# EAGLE design sqw23 (EAGLE 7.1.0)
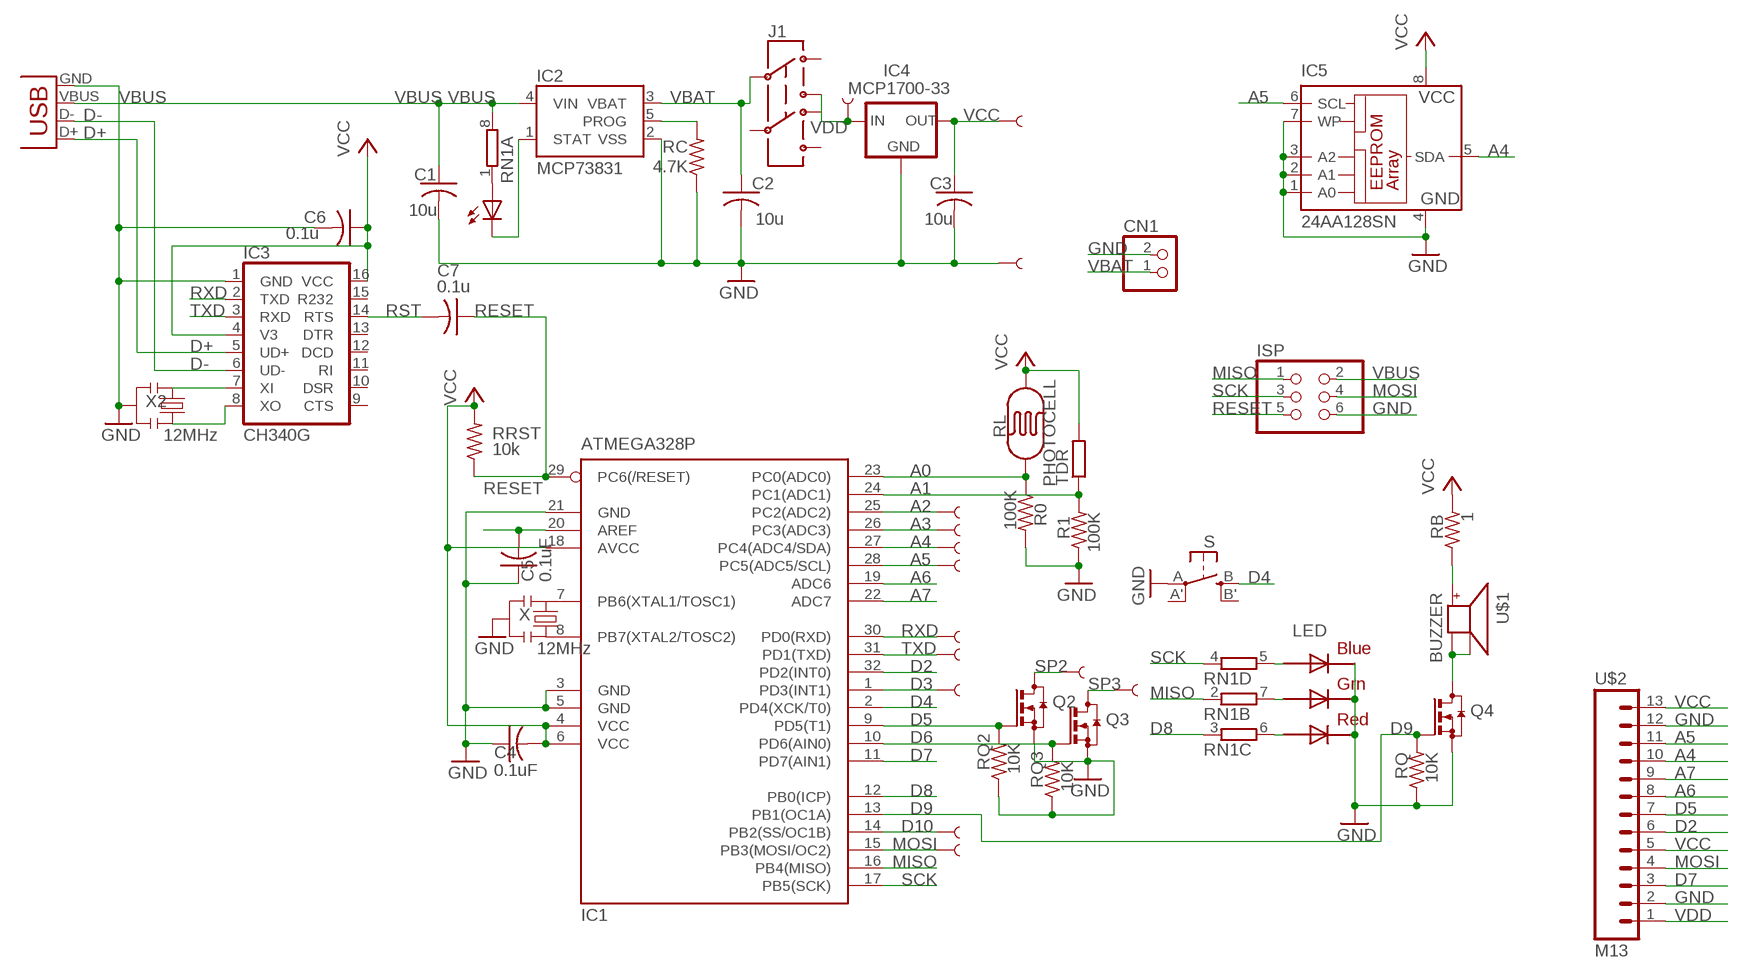
[diagram p0: schematic, sheet 1]

## Parts
C1  10u  C-USC0805K  [C0805K]
C2  10u  C-USC0805K  [C0805K]
C3  10u  C-USC0805K  [C0805K]
C4  0.1uF  C-USC0805K  [C0805K]
C5  0.1uF  C-USC0805K  [C0805K]
C6  0.1u  C-USC0805K  [C0805K]
C7  0.1u  C-USC0805K  [C0805K]
CHG  0805  LEDCHIPLED_0805  [CHIPLED_0805]
CN1  JST_2PIN-SMT-RA  [JST-PH-2-SMT-RA]
IC1  ATMEGA328P  MEGA8-AI  [TQFP32-08]
IC2  MCP73831  [SOT23-5]
IC3  CH340G  [SO16]
IC4  MCP1700-33  MCP1700SOT89  [SOT89]
IC5  24AA128SN  [SO-08]
ISP  PINHD-2X3  [2X03]
J1  AYZ0202  [AYZ0202]
LED  RGBLED5050  [RGBLED5050]
PAD_3  SEWTAP6  SEWTAP611  [PETAL-SMALL-2SIDE11]
PAD_5  SEWTAP6  SEWTAP61  [PETAL-SMALL-2SIDE1]
PAD_6  SEWTAP6  SEWTAP61  [PETAL-SMALL-2SIDE1]
PAD_10  SEWTAP6  SEWTAP611  [PETAL-SMALL-2SIDE11]
PAD_11  SEWTAP6  SEWTAP61  [PETAL-SMALL-2SIDE1]
PAD_A2  SEWTAP6  SEWTAP61  [PETAL-SMALL-2SIDE1]
PAD_A3  SEWTAP6  SEWTAP61  [PETAL-SMALL-2SIDE1]
PAD_A4  SEWTAP6  SEWTAP611  [PETAL-SMALL-2SIDE11]
PAD_A5  SEWTAP6  SEWTAP611  [PETAL-SMALL-2SIDE11]
PAD_GND  SEWTAP6  SEWTAP611  [PETAL-SMALL-2SIDE11]
PAD_RXD  SEWTAP61  [PETAL-SMALL-2SIDE1]
PAD_TXD  SEWTAP6  SEWTAP61  [PETAL-SMALL-2SIDE1]
PAD_VBAT  SEWTAP6  SEWTAP61  [PETAL-SMALL-2SIDE1]
PAD_VCC  SEWTAP6  SEWTAP611  [PETAL-SMALL-2SIDE11]
Q2  BSS123  [SOT23]
Q3  BSS123  [SOT23]
Q4  BSS123  [SOT23]
R0  100K  R-US_R0805  [R0805]
R1  100K  R-US_R0805  [R0805]
RB  1  R-US_R0805  [R0805]
RC  4.7K  R-US_R0805  [R0805]
RL  PHOTOCELL  PHOTOCELLPTH  [PHOTOCELL]
RN1  4R-NEXB38V  [EXB38V]
RQ  10K  R-US_R0805  [R0805]
RQ2  10K  R-US_R0805  [R0805]
RQ3  10K  R-US_R0805  [R0805]
RRST  10k  R-US_R0805  [R0805]
S  EVQQ2  [EVQ-Q2]
TDR  R-EU_V526-0  [V526-0]
U$1  BUZZER  [SMT-8585-BUZZER]
U$2  M13  [1X13]
X  12MHz  RESONATORSMD  [RESONATOR-SMD]
X1  USBSMD  [USB-MINIB]
X2  12MHz  RESONATORSMD  [RESONATOR-SMD]

## Nets
A0: IC1.23(PC0(ADC0)) R0.1 RL.1
A1: IC1.24(PC1(ADC1)) R1.2 TDR.1
A2: IC1.25(PC2(ADC2)) PAD_A2.1
A3: IC1.26(PC3(ADC3)) PAD_A3.1
A4: IC1.27(PC4(ADC4/SDA)) IC5.5(SDA) PAD_A4.1 U$2.10
A5: IC1.28(PC5(ADC5/SCL)) IC5.6(SCL) PAD_A5.1 U$2.11
A6: IC1.19(ADC6) U$2.8
A7: IC1.22(ADC7) U$2.9
AREF: C5.2 IC1.20(AREF)
D2: IC1.32(PD2(INT0)) U$2.6
D3: IC1.1(PD3(INT1)) PAD_3.1
D4: IC1.2(PD4(XCK/T0)) S.B(S)
D5: IC1.9(PD5(T1)) Q2.1(G) RQ2.2 U$2.7
D6: IC1.10(PD6(AIN0)) Q3.1(G) RQ3.2
D7: IC1.11(PD7(AIN1)) U$2.3
D8: IC1.12(PB0(ICP)) RN1.3
D9: IC1.13(PB1(OC1A)) Q4.1(G) RQ.2
D10: IC1.14(PB2(SS/OC1B)) PAD_10.1
D+: IC3.5(UD+) X1.D+
D-: IC3.6(UD-) X1.D-
GND: C1.2 C2.2 C3.2 C4.1 C5.1 C6.2 CN1.2 IC1.3(GND) IC1.5(GND) IC1.21(GND) IC2.2(VSS) IC3.1(GND) IC4.1(GND) IC5.1(A0) IC5.2(A1) IC5.3(A2) IC5.4(GND) IC5.7(WP) ISP.6 LED.4(BLUE_C) LED.5(RED_C) LED.6(GREEN_C) PAD_GND.1 Q2.2(S) Q3.2(S) Q4.2(S) R0.2 R1.1 RC.1 RQ2.1 RQ3.1 RQ.1 S.A(P) U$2.2 U$2.12 X1.GND X2.2 X.2
MISO: IC1.16(PB4(MISO)) ISP.1 RN1.2
MOSI: IC1.15(PB3(MOSI/OC2)) ISP.4 PAD_11.1 U$2.4
N$1: IC1.8(PB7(XTAL2/TOSC2)) X.3
N$2: IC1.7(PB6(XTAL1/TOSC1)) X.1
N$3: LED.3(BLUE_A) RN1.5
N$4: CHG.A RN1.1
N$5: CHG.C IC2.1(STAT)
N$6: IC2.5(PROG) RC.2
N$7: Q4.3(D) U$1.- U$1.A-
N$8: LED.1(GREEN_A) RN1.7
N$9: LED.2(RED_A) RN1.6
N$11: IC3.7(XI) X2.1
N$12: RB.1 U$1.+
N$13: IC3.8(XO) X2.3
RESET: C7.1 IC1.29(PC6(/RESET)) ISP.5 RRST.1
RST: C7.2 IC3.14(RTS)
RXD: IC1.30(PD0(RXD)) IC3.2(TXD) PAD_RXD.1
SCK: IC1.17(PB5(SCK)) ISP.3 RN1.4
SP2 [power]: PAD_5.1 Q2.3(D)
SP3 [power]: PAD_6.1 Q3.3(D)
TXD: IC1.31(PD1(TXD)) IC3.3(RXD) PAD_TXD.1
VBAT [power]: C2.1 CN1.1 IC2.3(VBAT) J1.2
VBUS [power]: C1.1 IC2.4(VIN) ISP.2 RN1.8 X1.VBUS
VCC: C3.1 C4.2 C6.1 IC1.4(VCC) IC1.6(VCC) IC1.18(AVCC) IC3.4(V3) IC3.16(VCC) IC4.3(OUT) IC5.8(VCC) PAD_VCC.1 RB.2 RL.2 RRST.2 TDR.2 U$2.5 U$2.13
VDD: IC4.2(IN) J1.1 PAD_VBAT.1 U$2.1
Unconnected: IC3.9(CTS) IC3.10(DSR) IC3.11(RI) IC3.12(DCD) IC3.13(DTR) IC3.15(R232) J1.3 J1.4 J1.5 J1.6 S.A'(P1) S.B'(S1)

## Library data of the parts
C1-C5 = adafruit2013:C-US: CAPACITOR, American symbol
C6 C7 = adafruit:C-US: CAPACITOR, American symbol
CHG = led:LED: LED OSRAM: - CHIPLED LG R971, LG N971, LY N971, LG Q971, LY Q971, LO R971, LY R971 LH N974, LH R974 LS Q976, LO Q976, LY Q976 LO Q996 - Hyper CHIPLED LW Q18S LB Q993, LB Q99A, LB R99A - SideLED LS A670, LO A670, LY A670, LG A670, LP A670 LB A673, LV A673, LT A673, LW A673 LH A674 LY A675 LS A676, LA A676, LO A676, LY A676, LW A676 LS A679, LY A679, LG A679 - Hyper Micro SIDELED® LS Y876, LA Y876, LO Y876, LY Y876 LT Y87S - SmartLED LW L88C, LW L88S LB L89C, LB L89S, LG L890 LS L89K, LO L89K, LY L89K LS L896, LA L896, LO L896, LY L896 - TOPLED LS T670, LO T670, LY T670, LG T670, LP T670 LSG T670, LSP T670, LSY T670, LOP T670, LYG T670 LG T671, LOG T671, LSG T671 LB T673, LV T673, LT T673, LW T673 LH T674 LS T676, LA T676, LO T676, LY T676, LB T676, LH T676, LSB T676, LW T676 LB T67C, LV T67C, LT T67C, LS T67K, LO T67K, LY T67K, LW E67C LS E67B, LA E67B, LO E67B, LY E67B, LB E67C, LV E67C, LT E67C LW T67C LS T679, LY T679, LG T679 LS T770, LO T770, LY T770, LG T770, LP T770 LB T773, LV T773, LT T773, LW T773 LH T774 LS E675, LA E675, LY E675, LS T675 LS T776, LA T776, LO T776, LY T776, LB T776 LHGB T686 LT T68C, LB T68C - Hyper Mini TOPLED® LB M676 - Mini TOPLED Santana® LG M470 LS M47K, LO M47K, LY M47K Source: http://www.osram.convergy.de LUXEON: - LUMILED® LXK2-PW12-R00, LXK2-PW12-S00, LXK2-PW14-U00, LXK2-PW14-V00 LXK2-PM12-R00, LXK2-PM12-S00, LXK2-PM14-U00 LXK2-PE12-Q00, LXK2-PE12-R00, LXK2-PE12-S00, LXK2-PE14-T00, LXK2-PE14-U00 LXK2-PB12-K00, LXK2-PB12-L00, LXK2-PB12-M00, LXK2-PB14-N00, LXK2-PB14-P00, LXK2-PB14-Q00 LXK2-PR12-L00, LXK2-PR12-M00, LXK2-PR14-Q00, LXK2-PR14-R00 LXK2-PD12-Q00, LXK2-PD12-R00, LXK2-PD12-S00 LXK2-PH12-R00, LXK2-PH12-S00 LXK2-PL12-P00, LXK2-PL12-Q00, LXK2-PL12-R00 Source: www.luxeon.com KINGBRIGHT: KA-3528ASYC Source: www.kingbright.com
CN1 = adafruit:JST_2PIN: JST 2-Pin Connectors of various flavors SMT-RA (S2B-PH-SM4) 4UConnector #17311 SMT (B2B-PH-SM4) THM-RA (S2B-PH) THM (B2B-PH)
IC1 = atmel:MEGA8: MICROCONTROLLER 8 Kbytes FLASH, 1 kbytes SRAM, 512 bytes EEPROM, USART, 6-channel 10 bit ADC, 2-channel 8 bit ADC Pin compatible with Atmega48, ATMega88, ATMega168 Source: avr.lbr; MPN: ATMEGA8-16AU; OC_FARNELL: 9171371; OC_NEWARK: 73M8863
IC2 = SparkFunNew:MCP73831: Microchip's MCP73831 Miniature single cell, fully integrated Li-Ion, Li-polymer charge management controller http://ww1.microchip.com/downloads/en/DeviceDoc/21984a.pdf
IC3 = SparkFunNew:CH340
IC4 = adafruit:MCP1700: VOLTAGE REGULATOR
IC5 = microchip:24*: Serial EEPROM I2C; MF: MICROCHIP; MPN: 24AA128-I/SN; OC_FARNELL: unknown; OC_NEWARK: 92C6842
ISP = pinhead:PINHD-2X3: PIN HEADER
J1 = SparkFunNew:AYZ0202: SPDT Slide Switch Simple SMD single-pull double-throw slide switch. Good for less than 350mA power switch, switching UARTs between devices, etc. Spark Fun Electronics SKU : COM-00597
LED = adafruit:RGBLED: For 5050 RGB LEDs, the order of the LEDs may vary from one manufacturer to another!
PAD_3 PAD_5 PAD_6 PAD_10 PAD_11 PAD_A2-PAD_A5 PAD_GND PAD_RXD PAD_TXD PAD_VBAT PAD_VCC = LilyPad-Wearables:SEWTAP
Q2-Q4 = transistor-small-signal:BSS123: N-CHANNEL MOS FET
R0 R1 RB RC RQ RQ2 RQ3 RRST = adafruit2013:R-US_: RESISTOR, American symbol
RL = SparkFunNew:PHOTOCELL: Photocell Also known as a CdS photoresistor. This is a low cost way to detect light levels. Resistance decreases with more incoming light. SparkFun SKU: SEN-09088
RN1 = resistor-dil:4R-N: Array Chip Resistor Source: RS Component / Phycomp; OC_FARNELL: unknown; OC_NEWARK: unknown
S = adafruit:EVQQ2: SMT 6mm switch, EVQQ2 series http://www.ladyada.net/library/eagle
TDR = resistor:R-EU_: RESISTOR, European symbol; SPICEPREFIX: R
U$1 = adafruit:BUZZER
U$2 = SparkFun:M13
X X2 = SparkFunNew:RESONATOR: Resonator Small SMD resonator. This is the itty bitty 10/20MHz resonators with built in caps. CSTCE10M0G55 and CSTCE20M0V53. Footprint has been reviewed closely but hasn't been tested yet.
X1 = SparkFun:USB: USB Connectors USB-B-PTH is fully proven SKU : PRT-00139 USB-miniB is fully proven SKU : PRT-00587 USB-A-PCB is untested. USB-A-H is throughly reviewed, but untested. Spark Fun Electronics SKU : PRT-00437 USB-B-SMT is throughly reviewed, but untested. Needs silkscreen touching up. USB-A-S has not been used/tested USB-MB-H has not been used/tested

## Net classes
0 default: width 0.178 mm, clearance 0.178 mm
1 power: width 0.254 mm, clearance 0.178 mm

## Board
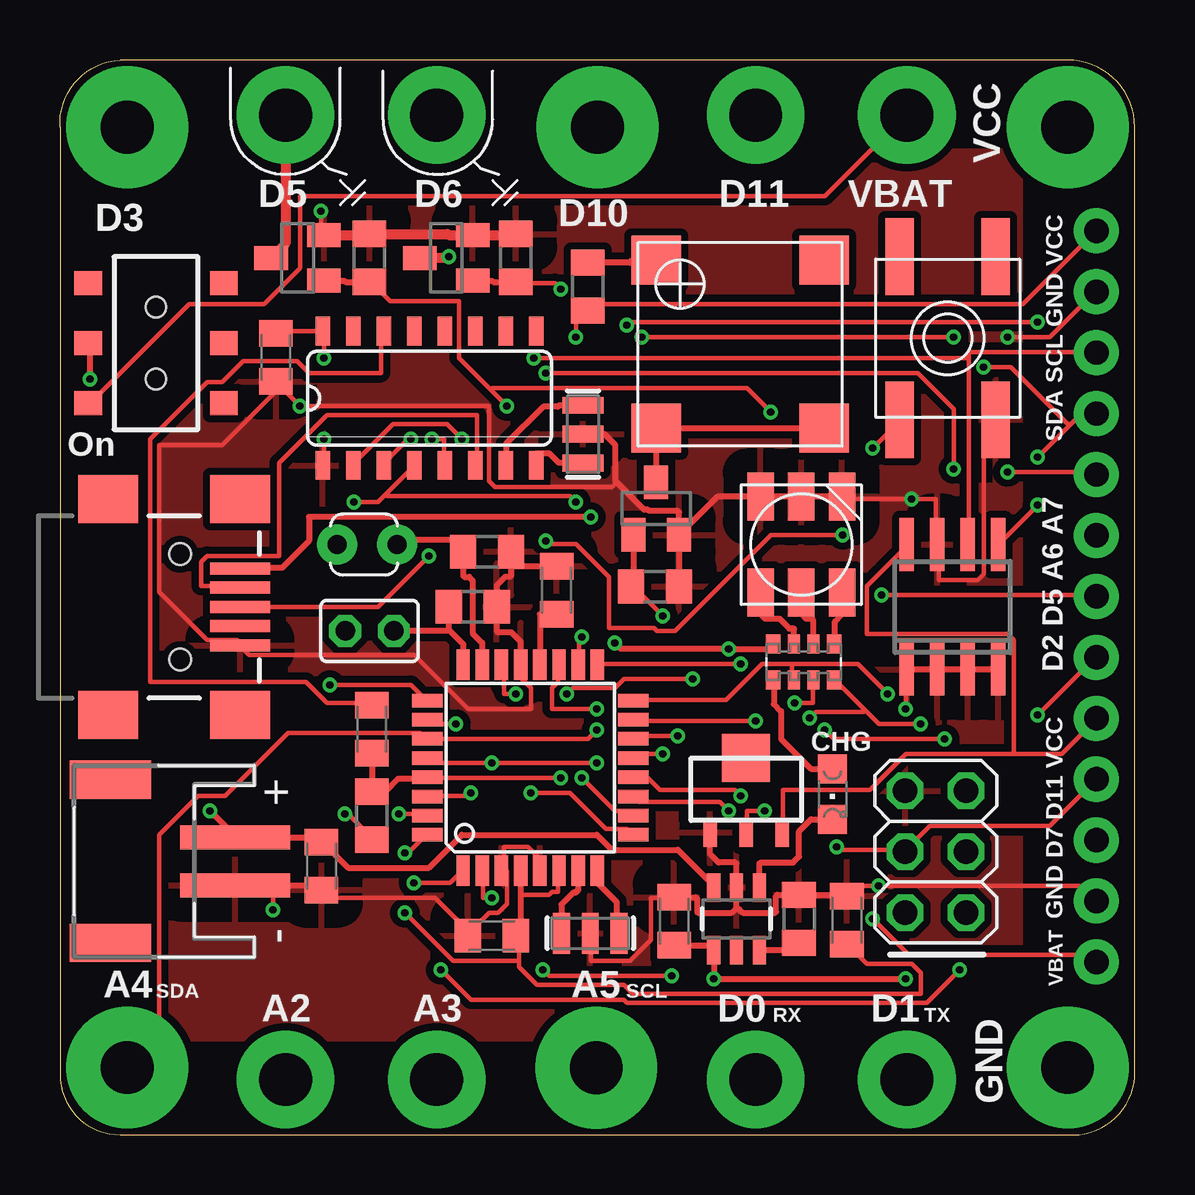
[diagram p1: board, top side]
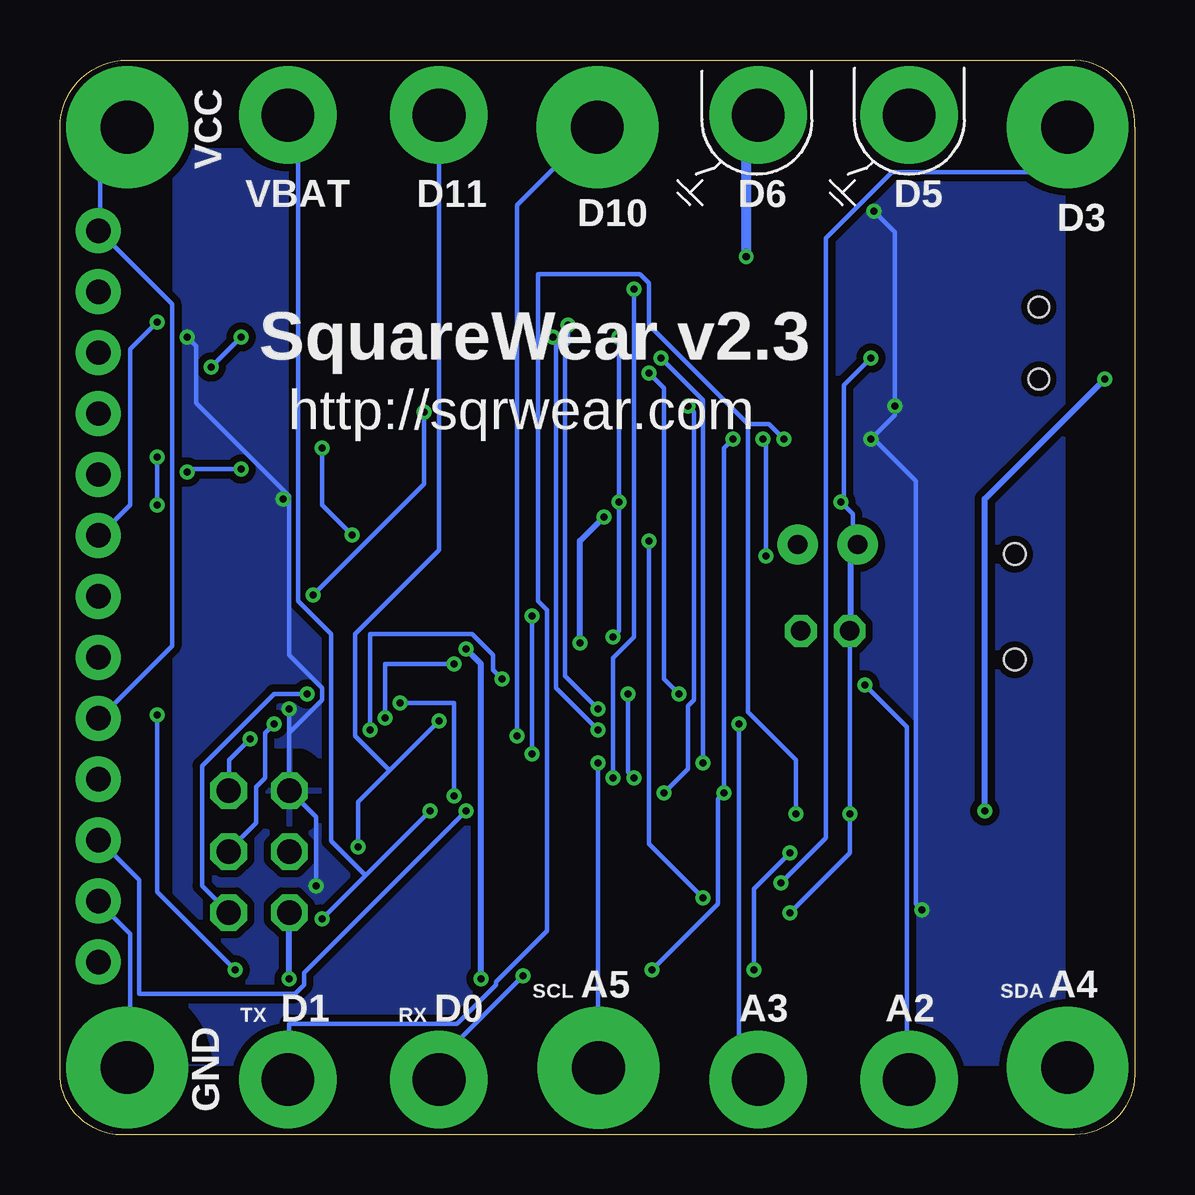
[diagram p2: board, bottom side, seen from below]

Size 44.8 x 44.81 mm. Coordinates in mm from the lower left corner, seen from the top.
Outline: 2.5,0.01 42,0.01 arc90 44.8,2.41 44.8,42.01 arc90 42,44.81 2.5,44.81 arc90 0,42.01 0,2.51 arc90 2.5,0.01
Copper layers (1*16): Top 0.035mm / dielectric 1.5mm / Bottom 0.035mm
Design rules "Fusion_eagle_rule_v1.1 *": minimum track width 6mil, minimum drill 12mil, track to track 6mil, track to pad 6mil, pad to pad 6mil, via to via 6mil, smd to smd 0mil, copper to edge 10mil, drill to drill 10mil, minimum pad ring 10mil, minimum via ring 6mil, stop-mask expansion 2mil, vias tented up to drill 100mil, thermal gap 40mil
vRestrict: area 41.1,6.2 to 41.8,38.8; area 1.8,5.7 to 5.6,6.8; area 8.5,4.7 to 10.4,5.8; area 14.7,4.7 to 16.5,5.8; area 21.3,5.7 to 25.1,6.8; area 27.4,4.7 to 30.7,5.8; area 33.9,4.7 to 37.3,5.8; area 14.5,38.7 to 16.8,39.8; area 20.5,37.8 to 23.4,39; area 27.2,38.7 to 30.2,39.8

### Footprints (pad centres in the part's own frame; a part is rotated, then mirrored left to right if it is on the bottom)
C0805K = smd 1.1 x 1.4: 1 -1,0; 2 1,0
CHIPLED_0805 = smd 1.2 x 1.2: A 0,-1.05; C 0,1.05
JST-PH-2-SMT-RA = smd 1 x 4.6: 1 1,-3.7; 2 -1,-3.7 | smd 1.6 x 3.4: NC1 -3.4,1.5; NC2 3.4,1.5
TQFP32-08 = smd 1.27 x 0.559: 1 -4.293,2.8; 2 -4.293,2; 3 -4.293,1.2; 4 -4.293,0.4; 5 -4.293,-0.4; 6 -4.293,-1.2; 7 -4.293,-2; 8 -4.293,-2.8; 17 4.293,-2.8; 18 4.293,-2; 19 4.293,-1.2; 20 4.293,-0.4; 21 4.293,0.4; 22 4.293,1.2; 23 4.293,2; 24 4.293,2.8 | smd 0.559 x 1.27: 9 -2.8,-4.293; 10 -2,-4.293; 11 -1.2,-4.293; 12 -0.4,-4.293; 13 0.4,-4.293; 14 1.2,-4.293; 15 2,-4.293; 16 2.8,-4.293; 25 2.8,4.293; 26 2,4.293; 27 1.2,4.293; 28 0.4,4.293; 29 -0.4,4.293; 30 -1.2,4.293; 31 -2,4.293; 32 -2.8,4.293
SOT23-5 = smd 0.55 x 1.2: 1 -0.95,-1.3; 2 0,-1.3; 3 0.95,-1.3; 4 0.95,1.3; 5 -0.95,1.3; 6 0,1.3
SO16 = smd 0.6 x 1.2: 1 -4.445,-2.8; 2 -3.175,-2.8; 3 -1.905,-2.8; 4 -0.635,-2.8; 5 0.635,-2.8; 6 1.905,-2.8; 7 3.175,-2.8; 8 4.445,-2.8; 9 4.445,2.8; 10 3.175,2.8; 11 1.905,2.8; 12 0.635,2.8; 13 -0.635,2.8; 14 -1.905,2.8; 15 -3.175,2.8; 16 -4.445,2.8
SOT89 = smd 0.58 x 1.2: 1 -1.5,-1.8; 2 0,-1.8; 3 1.5,-1.8 | smd 2 x 2: 4 0,1.3
SO-08 = smd 0.6 x 2.2: 1 -1.905,-2.6; 2 -0.635,-2.6; 3 0.635,-2.6; 4 1.905,-2.6; 5 1.905,2.6; 6 0.635,2.6; 7 -0.635,2.6; 8 -1.905,2.6
2X03 = drill 1.016 octagon: 1 -2.54,-1.27; 2 -2.54,1.27; 3 0,-1.27; 4 0,1.27; 5 2.54,-1.27; 6 2.54,1.27
AYZ0202 = smd 1 x 1.15: 1 -2.5,2.825; 2 0,2.825; 3 2.5,2.825; 4 -2.5,-2.825; 5 0,-2.825; 6 2.5,-2.825 | hole 0.85: 1.5,0; -1.5,0
RGBLED5050 = smd 2 x 1.1: 1 -2,1.7; 2 -2,0; 3 -2,-1.7; 4 2,-1.7; 5 2,0; 6 2,1.7
PETAL-SMALL-2SIDE11 = drill 2.2 pad 5.08: 1 0,0
PETAL-SMALL-2SIDE1 = drill 2.2 pad 4.064: 1 0,0
SOT23 = smd 1 x 1.4: 1 -0.95,-1.1; 2 0.95,-1.1; 3 0,1.1
R0805 = smd 1.1 x 1.4: 1 -1,0; 2 1,0
PHOTOCELL = drill 0.8 pad 1.676: 1 -1.246,0; 2 1.246,0
EXB38V = smd 0.6 x 0.8: 1 -1.275,-0.75; 4 1.275,-0.75; 5 1.275,0.75; 8 -1.275,0.75 | smd 0.5 x 0.8: 2 -0.4,-0.75; 3 0.4,-0.75; 6 0.4,0.75; 7 -0.4,0.75
EVQ-Q2 = smd 3.2 x 1.2: A -3.4,-2; A' 3.4,-2; B -3.4,2; B' 3.4,2
V526-0 = drill 0.813 octagon: 1 -1.016,0; 2 1.016,0
SMT-8585-BUZZER = smd 2.05 x 2.05: + -3.5,-3.5; - 3.5,-3.5; A- 3.5,3.5; NC1 -3.5,3.5
1X13 = drill 1.016 pad 1.88: 1 0,0; 2 2.54,0; 3 5.08,0; 4 7.62,0; 5 10.16,0; 6 12.7,0; 7 15.24,0; 8 17.78,0; 9 20.32,0; 10 22.86,0; 11 25.4,0; 12 27.94,0; 13 30.48,0
RESONATOR-SMD = smd 0.7 x 1.7: 1 -1.2,0; 2 0,0; 3 1.2,0
USB-MINIB = smd 2.5 x 0.5: D+ 2.5,0; D- 2.5,0.8; GND 2.5,-1.6; ID 2.5,-0.8; VBUS 2.5,1.6 | smd 2.5 x 2: GND@1 -3,-4.5; GND@2 -3,4.5; GND@3 2.5,4.5; GND@4 2.5,-4.5 | hole 0.9: 0,2.2; 0,-2.2

### Placement (x,y rotation side)
C1  25.6,8.91 90 top
C2  10.9,11.21 270 top
C3  32.8,8.96 90 top
C4  18,8.31 0 top
C5  20.7,22.71 270 top
C6  9,32.41 270 top
C7  13,16.91 90 top
CHG  32.2,14.21 180 top
CN1  3.6,11.41 90 top
IC1  19.6,15.31 90 top
IC2  28.2,9.01 180 top
IC3  15.4,30.71 0 top
IC4  28.6,14.41 0 top
IC5  37.2,22.01 0 top
ISP  36.5,11.81 90 top
J1  4,33.01 90 top
LED  30.9,24.61 90 top
PAD_3  2.8,42.01 180 top
PAD_5  9.4,42.51 180 top
PAD_6  15.7,42.51 0 top
PAD_10  22.4,42.01 180 top
PAD_11  29,42.51 180 top
PAD_A2  9.4,2.31 0 top
PAD_A3  15.7,2.31 0 top
PAD_A4  2.8,2.81 90 top
PAD_A5  22.35,2.8 0 top
PAD_GND  42,2.81 270 top
PAD_RXD  29,2.31 180 top
PAD_TXD  35.3,2.31 0 top
PAD_VBAT  35.3,42.51 180 top
PAD_VCC  42,42.01 180 top
Q2  9.9,36.56 90 top
Q3  16.1,36.56 90 top
Q4  24.85,26.11 0 top
R0  17.8,24.31 0 top
R1  17.2,22.01 180 top
RB  22,35.36 270 top
RC  30.8,9.01 270 top
RL  12.8,24.61 180 top
RN1  31,19.71 0 top
RQ  24.8,22.86 180 top
RQ2  12.9,36.56 270 top
RQ3  19,36.56 270 top
RRST  13,13.31 270 top
S  37,33.21 90 top
TDR  12.9,21.01 180 top
U$1  28.35,32.96 270 top
U$2  43.2,7.21 90 top
X  22.1,8.41 0 top
X1  5,22.01 0 top
X2  21.8,29.21 270 top

### Tracks (layer width: path | path; a pad name or v marks a point on that pad's centre or on a via)
A0
  Top 0.254: IC1.23 17.6,20.51 17.2,20.91 17.2,23.11 17.05,23.26 16.85,23.26 16.8,23.31 R0.1 16.8,24.81 14.25,24.81 RL.1
A1
  Top 0.254: IC1.24 16.8,20.46 16.2,21.06 | R1.2 16.2,21.06 | TDR.1 16.1,21.01 16.2,21.06
A2  (via drill 0.3)
  Top 0.178: v11.25,18.76 14.63,18.76 15.25,18.13 IC1.25
  Bottom 0.178: v11.25,18.76 9.5,17.01 9.5,2.38 PAD_A2.1
A3  (via drill 0.3)
  Top 0.178: v16.5,17.13 15.5,17.13 15.38,17.26 IC1.26
  Bottom 0.178: v16.5,17.13 16.5,3.13 15.75,2.38 PAD_A3.1
A4  (via drill 0.3)
  Top 0.178: v40.75,26.26 39.13,24.63 IC5.5 | 42.06,29.57 42.5,30.01 43.13,30.01 U$2.10 | 42.06,29.57 v40.75,28.26 | PAD_A4.1 2.88,2.88 4.13,2.88 4.13,12.51 5.75,14.13 6.88,14.13 9.5,16.76 15,16.76 15.25,16.51 IC1.27 22,16.51 v22.38,16.88 | 42.06,29.57 39.63,32.01 v38.5,32.01 | v24.25,33.26 v37.25,33.26
  Bottom 0.178: v40.75,28.26 v40.75,26.26 | v37.25,33.26 v38.5,32.01 | v24.25,33.26 24.13,33.13 24.13,18.63 v22.38,16.88
A5  (via drill 0.3)
  Top 0.178: 37.88,32.38 37.88,32.63 43.13,32.63 U$2.11 | 37.88,32.38 37.88,24.63 IC5.6 | v22.38,15.51 v18,15.51 15.5,15.51 15.38,15.63 IC1.28 | v19.75,32.38 37.88,32.38
  Bottom 0.178: v22.38,15.51 22.38,2.88 PAD_A5.1 | v19.75,32.38 18,30.63 v18,15.51
A6  (via drill 0.3)
  Top 0.178: v22.38,17.76 20.5,17.76 20.5,18.63 20.75,18.88 20.75,19.51 IC1.19 | v23.63,33.76 23.75,33.88 v40.75,33.88
  Bottom 0.178: v22.38,17.76 23.75,19.13 23.75,32.88 23.63,33.01 v23.63,33.76 | v40.75,33.88 41.88,32.76 41.88,26.26 43.13,25.01 U$2.8
A7  (via drill 0.3)
  Top 0.178: v19,18.38 18.5,18.38 18.5,19.51 IC1.22 | v20.25,31.76 35.75,31.76 37.25,30.26 v37.25,27.76 | v39.5,27.63 43.13,27.63 U$2.9
  Bottom 0.178: v19,18.38 19.63,19.01 19.63,31.13 v20.25,31.76 | v37.25,27.76 39.5,27.76 v39.5,27.63
AREF
  Top 0.254: IC1.20 20,21.71 C5.2
D2  (via drill 0.3)
  Top 0.178: v14.38,11.76 14.5,11.76 15.25,12.51 IC1.32 | v15.88,6.88 17.13,5.63 23.5,5.63 23.63,5.51 36.13,5.51 v37.5,6.88 | v40.75,17.51 43.13,19.88 U$2.6
  Bottom 0.178: v14.38,11.76 15.88,10.26 v15.88,6.88 | v37.5,6.88 40.75,10.13 v40.75,17.51
D3  (via drill 0.3)
  Top 0.178: v14.75,10.51 16.25,10.51 16.75,11.01 IC1.1
  Bottom 0.178: v14.75,10.51 12.88,12.38 12.88,37.38 10.13,40.13 2.88,40.13 2.88,42.01 PAD_3.1
D4  (via drill 0.3)
  Top 0.178: v18,9.88 17.63,9.88 17.63,11.01 IC1.2 | v20.25,24.76 20.38,24.63 21.5,24.63 22.88,23.26 22.88,21.13 24.75,21.13 24.88,21.01 25.63,21.01 29.63,25.01 v32.63,25.01 | v33.88,28.63 35,29.76 S.B
  Bottom 0.178: v18,9.88 20.25,12.13 v20.25,24.76 | v32.63,25.01 33.88,26.26 v33.88,28.63
D5  (via drill 0.3)
  Top 0.178: v19.63,14.26 21.25,14.26 22.75,12.76 23.63,12.76 23.88,12.51 IC1.9 | 17.94,31.07 16.63,32.38 16.63,34.76 13.75,34.76 13,35.51 RQ2.2 | 17.94,31.07 v18.63,30.38 | v34.25,22.51 43.13,22.51 U$2.7 | v29.63,30.13 28.63,31.13 18,31.13 17.94,31.07
  Top 0.254: RQ2.2 11.9,35.56 11.85,35.61 Q2.1
  Bottom 0.178: v19.63,14.26 18.63,15.26 18.63,17.88 18.38,18.13 18.38,30.13 v18.63,30.38 | v34.25,22.51 29.63,27.13 v29.63,30.13
D6  (via drill 0.3)
  Top 0.178: v21.75,14.88 23.13,13.51 23.75,13.51 23.88,13.38 IC1.10 | v20.88,35.26 20.63,35.51 19.13,35.51 RQ3.2
  Top 0.254: RQ3.2 18.05,35.56 18,35.61 Q3.1
  Bottom 0.178: v21.75,14.88 21.75,19.88 20.88,20.76 v20.88,35.26
D7  (via drill 0.3)
  Top 0.178: v27.88,13.51 27.5,13.88 24.13,13.88 24,14.01 IC1.11
  Bottom 0.178: v27.88,13.51 34.63,6.76 34.63,6.26 35,5.88 41.5,5.88 41.5,10.63 43.13,12.26 U$2.3
D8  (via drill 0.3)
  Top 0.178: v30.63,18.01 31.38,18.01 31.38,18.88 RN1.3 | v28.38,14.13 28.13,14.38 25,14.38 24.5,14.88 24,14.88 IC1.12
  Bottom 0.178: v30.63,18.01 28.38,18.01 v28.38,14.13
D9  (via drill 0.3)
  Top 0.178: v25.13,15.88 24.13,15.88 24,15.76 IC1.13 | v25.13,21.63 24,22.76 23.88,22.76 RQ.2
  Top 0.254: Q4.1 23.9,22.96 RQ.2
  Bottom 0.178: v25.13,21.63 v25.13,15.88
D10  (via drill 0.3)
  Top 0.178: v25.75,16.63 24.13,16.63 24,16.51 IC1.14
  Bottom 0.178: v25.75,16.63 25.75,38.76 22.5,42.01 PAD_10.1
D+  (via drill 0.3)
  Top 0.178: v15.5,29.01 16,29.01 16,28.01 IC3.5 | v15.38,24.13 13.25,22.01 X1.D+
  Bottom 0.178: v15.5,29.01 15.38,28.88 v15.38,24.13
D-
  Top 0.178: IC3.6 17.38,28.01 17.38,30.01 11.13,30.01 9.13,28.01 9.13,24.13 6.13,24.13 5.88,23.88 5.88,22.88 7.5,22.88 X1.D-
GND  (via drill 0.3)
  Top 0.178: LED.4 32.63,26.51 v35.5,26.51 36.5,26.51 36.5,24.63 IC5.7 36.63,24.51 36.63,23.13 38.25,23.13 38.5,23.38 38.5,29.76 39,29.76 S.A | IC1.5 20,11.51 19.5,12.01 18.5,12.01 18.5,11.13 IC1.3 18.5,11.01 18.63,11.01 18.63,9.63 18.25,9.26 17.88,9.26 17,8.38 C4.1 17,8.51 15.63,9.88 11.25,9.88 11,10.13 C2.2 | 11,27.88 IC3.1 11,28.01 v11,29.01 | IC1.21 19.25,19.51 19.25,19.01 19.63,18.63 19.63,17.76 17,17.76 14.75,20.01 7.88,20.01 7.5,20.38 X1.GND 7.5,20.51 7.38,20.63 6.13,20.63 4.13,22.63 4.13,28.76 6.75,28.76 9.13,31.13 C6.2 9,31.38 v10,30.38 17.88,30.38 17.88,27.26 18.13,27.01 23,27.01 23.2,27.21 | v10.88,38.51 10.88,37.63 Q2.2 | v8.88,9.38 8.88,10.38 CN1.2 | X.2 22.13,8.38 22.13,7.26 23.75,7.26 24.63,8.13 24.63,9.88 25.5,9.88 C1.2 | C3.2 32.88,10.01 33.25,10.38 v34.13,10.38 42.5,10.38 43.13,9.76 U$2.2 | v35.25,17.76 35.25,19.38 IC5.1 | v39.5,33.26 41.25,33.26 43.13,35.13 U$2.12
  Top 0.254: CN1.2 10.7,10.41 C2.2 | 18.8,23.71 C5.1 | R0.2 18.8,23.71 | 18.8,23.71 18.8,23.31 18.75,23.26 18.55,23.26 18.2,22.91 R1.1 18.2,21.01 18.25,20.96 18.8,20.96 19.2,20.56 IC1.21 | 28.2,9.46 IC2.2 28.2,11.31 28.15,11.36 27.45,11.36 27.1,11.71 IC4.1 | 28.2,9.46 28,9.26 26.6,9.26 26.55,9.31 26.55,9.86 26.5,9.91 C1.2 | 28.2,9.46 28.3,9.41 28.45,9.26 29.8,9.26 29.85,9.31 29.85,9.96 29.9,10.01 RC.1 32.75,10.01 C3.2 | LED.4 LED.5 LED.6 27.4,26.61 Q4.2 | Q4.2 RQ.1 | X2.2 22.7,29.21 23.15,28.76 23.15,27.26 23.2,27.21 24.35,26.06 24.5,26.06 24.55,26.01 25.75,26.01 25.8,25.96 Q4.2 | IC5.4 IC5.3 IC5.2 IC5.1
  Top 0.406: Q2.2 12.85,37.51 RQ2.1 16.15,37.56 16.2,37.51 Q3.2 18.95,37.51 RQ3.1
  Bottom 0.178: v10.88,38.51 10,37.63 v10,30.38 10,30.01 v11,29.01 10.88,29.01 9.13,27.26 9.13,9.63 v8.88,9.38 | v34.13,10.38 34.13,13.26 35.13,14.26 ISP.6 35.25,14.38 35.25,16.76 | 35.25,16.76 v35.25,17.76 | v39.5,33.26 39.13,32.88 39.13,30.51 35.31,26.7 | 35.31,26.7 35.25,26.63 35.25,20.01 33.88,18.63 33.88,18.13 35.25,16.76 | PAD_GND.1 42,2.88 41.88,3.01 41.88,8.38 43.13,9.63 U$2.2 | 35.31,26.7 v35.5,26.51
  pour Top (isolate 0.305): 3,41.01 40,41.01 40,4.01 3,4.01
  pour Bottom (isolate 0.305): 3,41.01 40,41.01 40,3.01 3,3.01
MISO  (via drill 0.3)
  Top 0.178: 30.5,19.63 30.5,19.01 RN1.2 | 30.5,19.63 29.25,19.63 27.75,18.13 24,18.13 IC1.16 | v34.5,18.38 33.25,19.63 30.5,19.63
  Bottom 0.178: v34.5,18.38 35.88,18.38 38.88,15.38 38.88,10.38 37.88,9.38 ISP.1
MOSI  (via drill 0.3)
  Top 0.178: v29,17.26 24,17.26 IC1.15 | v32.38,12.01 32.5,11.88 35.13,11.88 ISP.4 35.25,11.88 36.25,12.88 41.25,12.88 43.13,14.76 U$2.4
  Bottom 0.178: 31.06,15.2 32.38,13.88 v32.38,12.01 | 31.06,15.2 v29,17.26 | PAD_11.1 29,24.38 32.5,20.88 32.5,16.63 31.06,15.2
N$1
  Top 0.254: IC1.8 22.4,10.51 23.2,9.71 23.2,8.51 X.3
N$2
  Top 0.254: IC1.7 21.6,10.21 21.5,10.11 21.4,10.11 20.9,9.61 X.1
N$3
  Top 0.254: LED.3 32.6,21.71 32.3,21.41 32.3,20.46 RN1.5
N$4
  Top 0.254: CHG.A 31.3,15.26 30.05,16.51 30.05,17.66 29.75,17.96 29.75,18.96 RN1.1
N$5
  Top 0.254: CHG.C 31.3,13.16 30.8,12.66 30.8,11.61 30.55,11.36 29.2,11.36 29.15,11.31 IC2.1
N$6
  Top 0.254: IC2.5 30.5,7.71 RC.2
N$7
  Top 0.254: Q4.3 U$1.- U$1.A-
N$8
  Top 0.254: LED.1 29.2,21.71 29.4,21.51 30,21.51 30.4,21.11 30.6,21.11 RN1.7
N$9
  Top 0.254: LED.2 30.9,21.71 31.1,21.51 31.35,21.51 31.4,21.46 RN1.6
N$11
  Top 0.254: X2.1 20.8,30.41 20.75,30.36 20.15,30.36 18.6,28.81 18.6,27.91 IC3.7
N$12
  Top 0.254: RB.1 23.75,36.36 23.85,36.46 U$1.+
N$13
  Top 0.254: X2.3 20.8,28.01 20.4,28.41 19.85,28.41 IC3.8
RESET  (via drill 0.3)
  Top 0.178: v20.88,14.88 15.38,14.88 IC1.29 | v21.13,18.38 21.38,18.63 23.13,18.63 23.5,19.01 v26.38,19.01 | v31.88,16.88 32.25,16.51 v36.88,16.51
  Top 0.254: C7.1 RRST.1 13.55,14.31 14.1,14.86 15.26,14.86 IC1.29
  Bottom 0.178: v20.88,14.88 21.13,15.13 v21.13,18.38 | v26.38,19.01 26.75,19.38 26.75,20.01 27.63,20.88 31.88,20.88 v31.88,16.88 | v36.88,16.51 37.75,15.63 37.75,14.38 ISP.5
RST
  Top 0.178: IC3.14 13.38,33.51 13.38,31.76 10.38,31.76 9.88,32.26 7.63,32.26 6.75,31.38 6.13,31.38 3.75,29.01 3.75,18.88 10.25,18.88 11.13,18.01 13,18.01 C7.2
RXD  (via drill 0.3)
  Top 0.178: v16.75,29.01 16.13,29.63 13.88,29.63 12.25,28.01 IC3.2 | v17.13,14.26 17,14.13 15.38,14.13 IC1.30 | v20.13,6.88 20.38,6.63 v25.5,6.63
  Bottom 0.178: v16.75,29.01 17.13,28.63 v17.13,14.26 17.38,14.01 17.38,9.63 v20.13,6.88 | v25.5,6.63 29,3.13 PAD_RXD.1
SCK  (via drill 0.3)
  Top 0.178: 33.56,17.7 34.13,17.13 v35.88,17.13 | 33.56,17.7 32.38,18.88 RN1.4 | v28.38,19.63 22.5,19.63 IC1.17 | v31.25,17.38 31.5,17.63 33.5,17.63 33.56,17.7
  Bottom 0.178: v35.88,17.13 36.25,16.76 36.25,14.88 36.63,14.51 36.63,13.01 37.75,11.88 ISP.3 | v28.38,19.63 31.25,19.63 v31.25,17.38
SP2
  Top 0.406: PAD_5.1 9.4,37.16 Q2.3
SP3  (via drill 0.3)
  Top 0.406: Q3.3 16,36.56 16.05,36.61 v16.2,36.61
  Bottom 0.406: v16.2,36.61 16.2,42.01 PAD_6.1
TXD  (via drill 0.3)
  Top 0.178: v14.63,29.01 14.5,29.01 13.5,28.01 IC3.3 | v14.13,13.38 15.25,13.38 IC1.31
  Bottom 0.178: v14.63,29.01 15.25,29.63 16.13,29.63 | 16.13,29.63 16.13,17.63 14.13,15.63 v14.13,13.38 | 16.13,29.63 20.25,33.76 20.25,35.51 20.63,35.88 24.88,35.88 24.88,22.26 24.5,21.88 24.5,8.51 26.63,6.38 26.63,6.26 28.25,4.63 35.25,4.63 35.25,2.38 PAD_TXD.1
VBAT  (via drill 0.3)
  Top 0.254: v1.25,31.51 1.25,33.01 J1.2 | v6.25,13.51 7.25,12.51 CN1.1 10.7,12.41 C2.1 11,12.13 12,11.13 15.38,11.13 16.75,12.51 22.38,12.51 23,11.88 25.75,11.88 27.25,10.38 IC2.3
  Bottom 0.254: v1.25,31.51 6.25,26.51 v6.25,13.51
VBUS  (via drill 0.3)
  Top 0.254: C1.1 27.05,7.91 IC2.4 v27.25,6.51 v35.25,6.51 | RN1.8 29.63,20.38 29.5,20.26 v27.88,20.26 23.38,20.26 v23.13,20.51 | v22.13,25.76 10.38,25.76 10.38,24.76 9.25,23.63 7.5,23.63 X1.VBUS
  Bottom 0.254: v27.88,20.26 27.25,19.63 v27.25,6.51 | v22.13,25.76 23.13,24.76 v23.13,20.51 | v35.25,6.51 35.25,9.26 ISP.2
VCC  (via drill 0.3)
  Top 0.178: 19.2,10.01 20.38,10.01 20.5,10.13 20.75,10.13 20.75,11.01 IC1.6 | C3.1 33.63,7.13 35.5,7.13 35.88,6.76 35.88,5.88 23.88,5.88 23.5,6.26 19.88,6.26 19.13,7.01 19.13,7.26 | 19.13,7.26 19.13,8.26 C4.2 | C6.1 9,33.51 IC3.16 11,33.51 v11,32.38 | 13.56,26.7 13.25,26.38 v12.25,26.38 | 13.56,26.7 14.75,27.88 IC3.4 | v21.75,20.76 21.63,20.76 21.63,19.63 IC1.18 | v21.5,26.38 21.25,26.63 13.63,26.63 13.56,26.7 | v11.88,13.38 12,13.38 13,12.38 RRST.2 | 19.13,7.26 16.38,7.26 v14.38,9.26 | 35.25,24.63 IC5.8 35.25,24.51 33.63,22.88 33.63,20.88 39.5,20.88 39.75,20.63 39.75,15.88 | 39.75,15.88 41.75,15.88 43.13,17.26 U$2.5 | 39.75,15.88 35.25,15.88 33.75,14.38 30.13,14.38 30.13,12.63 IC4.3 | U$2.13 43.13,37.63 40.13,34.63 22.25,34.63 22,34.38 RB.2 22,34.26 21.5,34.26 v21.5,33.26
  Top 0.254: IC1.4 19.2,10.01 19.2,8.51 C4.2
  Bottom 0.178: RL.2 11.75,24.63 11.75,25.88 v12.25,26.38 12.13,26.38 12.13,31.26 v11,32.38 | v21.75,20.76 21.5,21.01 v21.5,26.38 v21.5,33.26 | TDR.2 11.88,20.88 v11.88,13.38 11.88,11.76 v14.38,9.26 | PAD_VCC.1 43.13,40.88 43.13,37.76 U$2.13 43.13,37.63 40.13,34.63 40.13,20.38 43.13,17.38 U$2.5
  Bottom 0.254: TDR.2 11.85,21.01 11.85,24.36 11.6,24.61 RL.2
VDD  (via drill 0.3)
  Top 0.178: v29.38,13.51 28.63,13.51 28.63,12.63 IC4.2 | v33.88,9.01 35.38,7.51 42.88,7.51 43.13,7.26 U$2.1 | J1.1 1.25,30.51 5.38,34.63 8.5,34.63 10,36.13 10,39.13 31.88,39.13 35.25,42.51 PAD_VBAT.1
  Bottom 0.178: v33.88,9.01 32.06,10.82 | 32.06,10.82 v29.38,13.51 | 32.06,10.82 33.5,12.26 33.5,20.88 34.88,22.26 34.88,42.13 35.25,42.51 PAD_VBAT.1

### Text on the board
tNames: D5 | D6 | D11 | VBAT | VCC | D3 | D10 | On | SDA SCL GND VCC | D2 D5 A6 A7 | GND D7 D11 VCC | A4 | SDA | A5 | SCL | VBAT | A2 | A3 | D0 | RX | D1 | TX | GND
bNames: VCC | D5 | D6 | D11 | VBAT | D3 | D10 | SquareWear v2.3 | http://sqrwear.com | A4 | SDA | A5 | SCL | A2 | A3 | D0 | RX | D1 | TX | GND